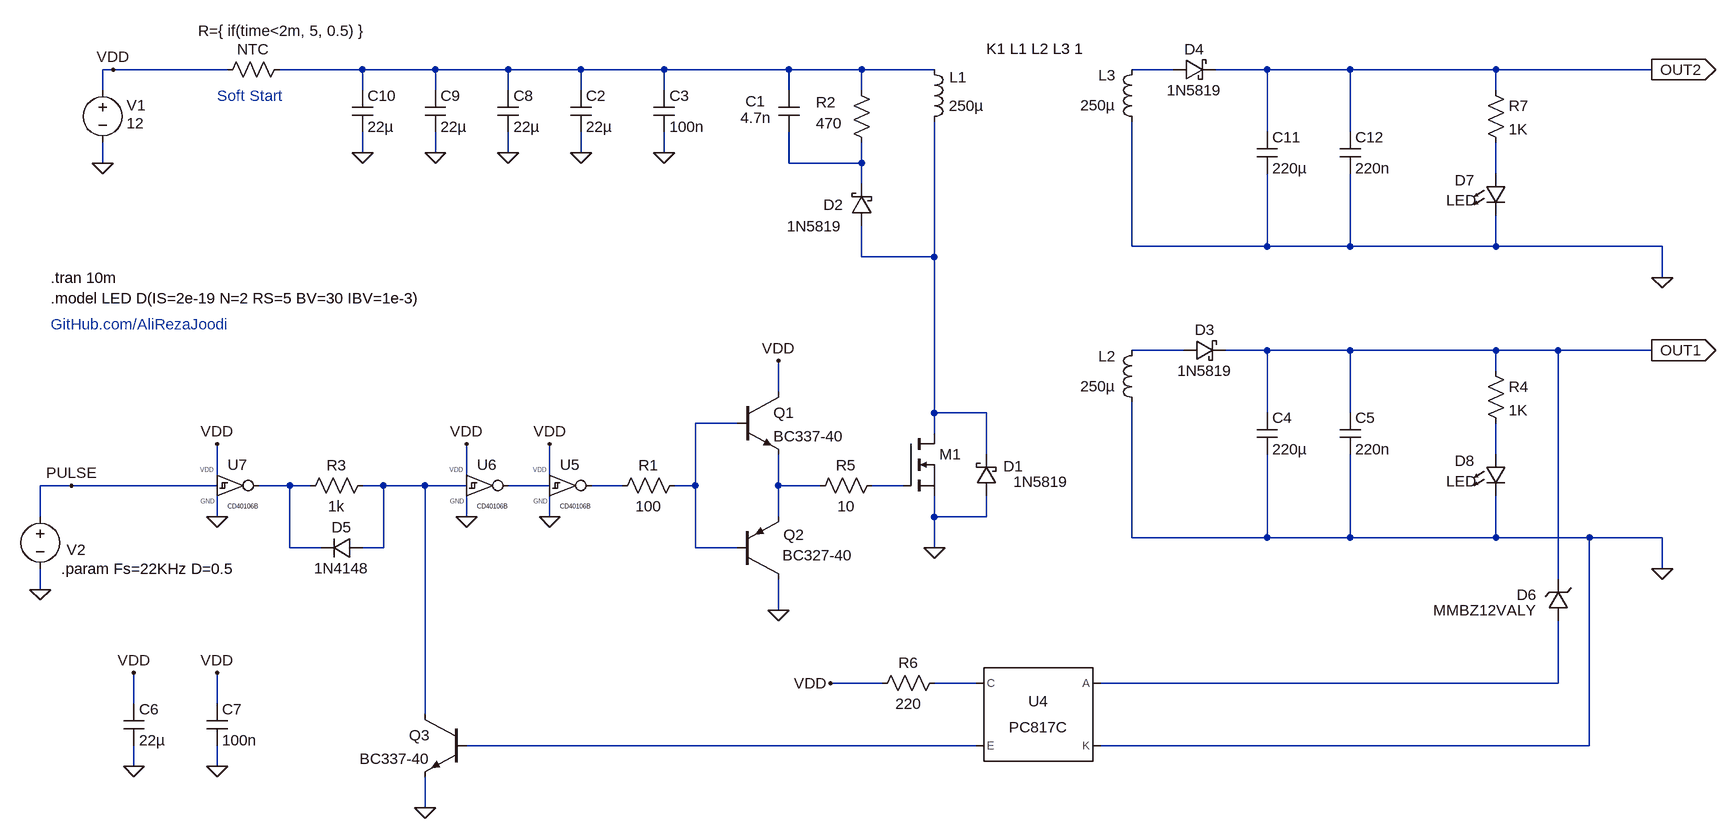
[diagram p0: schematic v1.0.asc]
v1.0.asc, the LTspice schematic file:
Version 4.1
SHEET 1 2620 1460
WIRE -48 192 -64 192
WIRE 128 192 -48 192
WIRE 336 192 208 192
WIRE 448 192 336 192
WIRE 560 192 448 192
WIRE 672 192 560 192
WIRE 800 192 672 192
WIRE 992 192 800 192
WIRE 1104 192 992 192
WIRE 1216 192 1104 192
WIRE 1584 192 1520 192
WIRE 1728 192 1648 192
WIRE 1856 192 1728 192
WIRE 2080 192 1856 192
WIRE 2320 192 2080 192
WIRE -64 224 -64 192
WIRE 336 224 336 192
WIRE 448 224 448 192
WIRE 560 224 560 192
WIRE 672 224 672 192
WIRE 800 224 800 192
WIRE 992 224 992 192
WIRE 1104 224 1104 192
WIRE 2080 224 2080 192
WIRE 1728 288 1728 192
WIRE 1856 288 1856 192
WIRE 336 320 336 288
WIRE 448 320 448 288
WIRE 560 320 560 288
WIRE 672 320 672 288
WIRE 800 320 800 288
WIRE -64 336 -64 304
WIRE 992 336 992 288
WIRE 1104 336 1104 304
WIRE 1104 336 992 336
WIRE 2080 352 2080 304
WIRE 1104 368 1104 336
WIRE 1520 464 1520 272
WIRE 1728 464 1728 352
WIRE 1728 464 1520 464
WIRE 1856 464 1856 352
WIRE 1856 464 1728 464
WIRE 2080 464 2080 416
WIRE 2080 464 1856 464
WIRE 2336 464 2080 464
WIRE 1104 480 1104 432
WIRE 1216 480 1216 272
WIRE 1216 480 1104 480
WIRE 2336 512 2336 464
WIRE 1600 624 1520 624
WIRE 1728 624 1664 624
WIRE 1856 624 1728 624
WIRE 2080 624 1856 624
WIRE 2176 624 2080 624
WIRE 2320 624 2176 624
WIRE 2080 656 2080 624
WIRE 976 688 976 640
WIRE 1216 720 1216 480
WIRE 1296 720 1216 720
WIRE 1728 720 1728 624
WIRE 1856 720 1856 624
WIRE 912 736 848 736
WIRE 1216 752 1216 720
WIRE 1296 784 1296 720
WIRE 2080 784 2080 736
WIRE 112 816 112 768
WIRE 496 816 496 768
WIRE 624 816 624 768
WIRE -112 832 -160 832
WIRE 112 832 -112 832
WIRE 224 832 176 832
WIRE 256 832 224 832
WIRE 368 832 336 832
WIRE 432 832 368 832
WIRE 496 832 432 832
WIRE 624 832 560 832
WIRE 736 832 688 832
WIRE 848 832 848 736
WIRE 848 832 816 832
WIRE 976 832 976 784
WIRE 1040 832 976 832
WIRE 1168 832 1120 832
WIRE -160 880 -160 832
WIRE 112 880 112 848
WIRE 496 880 496 848
WIRE 624 880 624 848
WIRE 976 880 976 832
WIRE 1216 880 1216 848
WIRE 1296 880 1296 848
WIRE 1296 880 1216 880
WIRE 1520 912 1520 704
WIRE 1728 912 1728 784
WIRE 1728 912 1520 912
WIRE 1856 912 1856 784
WIRE 1856 912 1728 912
WIRE 2080 912 2080 848
WIRE 2080 912 1856 912
WIRE 2224 912 2080 912
WIRE 2336 912 2224 912
WIRE 224 928 224 832
WIRE 272 928 224 928
WIRE 368 928 368 832
WIRE 368 928 336 928
WIRE 848 928 848 832
WIRE 912 928 848 928
WIRE 1216 928 1216 880
WIRE 2336 960 2336 912
WIRE 2176 976 2176 624
WIRE -160 992 -160 960
WIRE 976 1024 976 976
WIRE 1136 1136 1056 1136
WIRE 1280 1136 1216 1136
WIRE 2176 1136 2176 1040
WIRE 2176 1136 1472 1136
WIRE -16 1168 -16 1120
WIRE 112 1168 112 1120
WIRE 432 1184 432 832
WIRE 1280 1232 496 1232
WIRE 2224 1232 2224 912
WIRE 2224 1232 1472 1232
WIRE -16 1264 -16 1232
WIRE 112 1264 112 1232
WIRE 432 1328 432 1280
FLAG -64 336 0
FLAG -160 992 0
FLAG -112 832 PULSE
FLAG 1216 928 0
FLAG 672 320 0
FLAG 800 320 0
FLAG 2336 960 0
FLAG 2320 624 OUT1
IOPIN 2320 624 Out
FLAG -48 192 VDD
FLAG 976 640 VDD
FLAG 976 1024 0
FLAG 112 880 0
FLAG 112 768 VDD
FLAG 496 880 0
FLAG 496 768 VDD
FLAG 624 880 0
FLAG 624 768 VDD
FLAG 432 1328 0
FLAG 1056 1136 VDD
FLAG -16 1120 VDD
FLAG -16 1264 0
FLAG 112 1264 0
FLAG 560 320 0
FLAG 448 320 0
FLAG 336 320 0
FLAG 2336 512 0
FLAG 2320 192 OUT2
IOPIN 2320 192 Out
FLAG 112 1120 VDD
SYMBOL voltage -64 208 R0
WINDOW 123 0 0 Left 0
WINDOW 39 24 105 Left 2
WINDOW 0 37 39 Left 2
WINDOW 3 37 67 Left 2
SYMATTR InstName V1
SYMATTR Value 12
SYMBOL voltage -160 864 R0
WINDOW 123 0 0 Left 0
WINDOW 39 0 0 Left 0
WINDOW 0 41 67 Left 2
WINDOW 3 -361 80 Invisible 2
SYMATTR InstName V2
SYMATTR Value PULSE(0 9 0 {0.01/Fs} {0.01/Fs} {D/Fs} {1/Fs})
SYMBOL ind 1200 288 M180
WINDOW 0 39 84 Left 2
WINDOW 3 38 40 Left 2
SYMATTR InstName L1
SYMATTR Value 250µ
SYMATTR SpiceLine Rser=0.07
SYMATTR Type ind
SYMBOL cap 1008 288 R180
WINDOW 0 52 47 Left 2
WINDOW 3 43 22 Left 2
SYMATTR InstName C1
SYMATTR Value 4.7n
SYMBOL res 1088 208 R0
WINDOW 0 -54 34 Left 2
WINDOW 3 -54 67 Left 2
SYMATTR InstName R2
SYMATTR Value 470
SYMBOL nmos 1168 752 R0
WINDOW 3 56 72 Invisible 2
SYMATTR Value BSC100N06LS3
SYMATTR InstName M1
SYMBOL cap 656 224 R0
SYMATTR InstName C2
SYMATTR Value 22µ
SYMBOL schottky 1120 432 R180
WINDOW 0 44 32 Left 2
WINDOW 3 131 -1 Right 2
SYMATTR InstName D2
SYMATTR Value 1N5819
SYMBOL cap 784 224 R0
SYMATTR InstName C3
SYMATTR Value 100n
SYMBOL schottky 1312 848 R180
WINDOW 0 -41 46 Left 2
WINDOW 3 -110 22 Left 2
SYMATTR InstName D1
SYMATTR Value 1N5819
SYMBOL ind 1536 608 M0
WINDOW 0 41 25 Left 2
WINDOW 3 41 71 Left 2
SYMATTR InstName L2
SYMATTR Value 250µ
SYMATTR SpiceLine Rser=0.07
SYMATTR Type ind
SYMBOL schottky 1600 640 R270
WINDOW 0 32 32 VTop 2
WINDOW 3 0 32 VBottom 2
SYMATTR InstName D3
SYMATTR Value 1N5819
SYMBOL cap 1712 720 R0
SYMATTR InstName C4
SYMATTR Value 220µ
SYMBOL cap 1840 720 R0
SYMATTR InstName C5
SYMATTR Value 220n
SYMBOL res 2064 640 R0
SYMATTR InstName R4
SYMATTR Value 1K
SYMBOL npn 912 688 R0
SYMATTR InstName Q1
SYMATTR Value BC337-40
SYMBOL pnp 912 976 M180
WINDOW 0 72 68 Left 2
WINDOW 3 70 37 Left 2
SYMATTR InstName Q2
SYMATTR Value BC327-40
SYMBOL res 1024 848 R270
WINDOW 0 32 56 VTop 2
WINDOW 3 0 56 VBottom 2
SYMATTR InstName R5
SYMATTR Value 10
SYMBOL res 720 848 R270
WINDOW 0 32 56 VTop 2
WINDOW 3 0 56 VBottom 2
SYMATTR InstName R1
SYMATTR Value 100
SYMBOL res 240 848 R270
WINDOW 0 32 56 VTop 2
WINDOW 3 0 56 VBottom 2
SYMATTR InstName R3
SYMATTR Value 1k
SYMBOL diode 336 912 R90
WINDOW 0 0 32 VBottom 2
WINDOW 3 32 32 VTop 2
SYMATTR InstName D5
SYMATTR Value 1N4148
SYMBOL npn 496 1184 M0
SYMATTR InstName Q3
SYMATTR Value BC337-40
SYMBOL res 1120 1152 R270
WINDOW 0 32 56 VTop 2
WINDOW 3 0 56 VBottom 2
SYMATTR InstName R6
SYMATTR Value 220
SYMBOL Optos\\PC817C 1376 1184 M0
SYMATTR InstName U4
SYMBOL zener 2192 1040 R180
WINDOW 0 49 40 Left 2
WINDOW 3 49 16 Left 2
SYMATTR InstName D6
SYMATTR Value MMBZ12VALY
SYMBOL cap -32 1168 R0
SYMATTR InstName C6
SYMATTR Value 22µ
SYMBOL cap 96 1168 R0
SYMATTR InstName C7
SYMATTR Value 100n
SYMBOL cap 544 224 R0
SYMATTR InstName C8
SYMATTR Value 22µ
SYMBOL cap 432 224 R0
SYMATTR InstName C9
SYMATTR Value 22µ
SYMBOL cap 320 224 R0
SYMATTR InstName C10
SYMATTR Value 22µ
SYMBOL ind 1536 176 M0
WINDOW 0 41 25 Left 2
WINDOW 3 41 71 Left 2
SYMATTR InstName L3
SYMATTR Value 250µ
SYMATTR SpiceLine Rser=0.07
SYMATTR Type ind
SYMBOL schottky 1584 208 R270
WINDOW 0 32 32 VTop 2
WINDOW 3 0 32 VBottom 2
SYMATTR InstName D4
SYMATTR Value 1N5819
SYMBOL cap 1712 288 R0
SYMATTR InstName C11
SYMATTR Value 220µ
SYMBOL cap 1840 288 R0
SYMATTR InstName C12
SYMATTR Value 220n
SYMBOL res 2064 208 R0
SYMATTR InstName R7
SYMATTR Value 1K
SYMBOL res 112 208 R270
WINDOW 0 32 56 VTop 2
WINDOW 3 91 100 VBottom 2
SYMATTR InstName NTC
SYMATTR Value R={ if(time<2m, 5, 0.5) }
SYMBOL MyLib\\Digital\\CD40106B 624 800 R0
WINDOW 38 16 64 Left 0
SYMATTR InstName U5
SYMBOL MyLib\\Digital\\CD40106B 496 800 R0
WINDOW 38 16 64 Left 0
SYMATTR InstName U6
SYMBOL MyLib\\Digital\\CD40106B 112 800 R0
WINDOW 38 16 64 Left 0
SYMATTR InstName U7
SYMBOL LED 2064 352 R0
WINDOW 0 -47 10 Left 2
WINDOW 3 -60 41 Left 2
SYMATTR InstName D7
SYMATTR Value LED
SYMBOL LED 2064 784 R0
WINDOW 0 -47 10 Left 2
WINDOW 3 -60 41 Left 2
SYMATTR InstName D8
SYMATTR Value LED
TEXT -144 512 Left 2 !.tran 10m
TEXT 1296 160 Left 2 !K1 L1 L2 L3 1
TEXT -128 960 Left 2 !.param Fs=22KHz D=0.5
TEXT 112 232 Left 2 ;Soft Start
TEXT -144 544 Left 2 !.model LED D(IS=2e-19 N=2 RS=5 BV=30 IBV=1e-3)
TEXT -144 584 Left 2 ;GitHub.com/AliRezaJoodi

The netlist it stands for:
* v1.0.asc
V1 VDD 0 12
V2 PULSE 0 PULSE(0 9 0 {0.01/Fs} {0.01/Fs} {D/Fs} {1/Fs})
L1 N005 N001 250µ Rser=0.07
C1 N003 N001 4.7n
R2 N001 N003 470
M1 N005 N014 0 0 BSC100N06LS3
C2 N001 0 22µ
D2 N005 N003 1N5819
C3 N001 0 100n
D1 0 N005 1N5819
L2 N006 0 250µ Rser=0.07
D3 N006 OUT1 1N5819
C4 OUT1 0 220µ
C5 OUT1 0 220n
R4 OUT1 N008 1K
Q1 VDD N007 N013 0 BC337-40
Q2 0 N007 N013 0 BC327-40
R5 N013 N014 10
R1 N012 N007 100
R3 N009 N010 1k
D5 N010 N009 1N4148
Q3 N010 N017 0 0 BC337-40
R6 VDD N015 220
X§U4 N016 0 N015 N017 PC817 Igain=2.3m  ; PC817C, pins A K C E
D6 N016 OUT1 MMBZ12VALY
C6 VDD 0 22µ
C7 VDD 0 100n
C8 N001 0 22µ
C9 N001 0 22µ
C10 N001 0 22µ
L3 N002 0 250µ Rser=0.07
D4 N002 OUT2 1N5819
C11 OUT2 0 220µ
C12 OUT2 0 220n
R7 OUT2 N004 1K
R§NTC VDD N001 R={ if(time<2m, 5, 0.5) }
X§U5 N011 N012 VDD 0 CD40106B vdd=5 speed=2 tripdt=100n  ; pins in out VDD GND
X§U6 N010 N011 VDD 0 CD40106B vdd=5 speed=2 tripdt=100n  ; pins in out VDD GND
X§U7 PULSE N009 VDD 0 CD40106B vdd=5 speed=2 tripdt=100n  ; pins in out VDD GND
D7 N004 0 LED
D8 N008 0 LED
.model D D
.lib standard.dio
.model NPN NPN
.model PNP PNP
.lib standard.bjt
.model NMOS NMOS
.model PMOS PMOS
.lib standard.mos
.tran 10m
K1 L1 L2 L3 1
.param Fs=22KHz D=0.5
* Soft Start
.model LED D(IS=2e-19 N=2 RS=5 BV=30 IBV=1e-3)
* GitHub.com/AliRezaJoodi
.lib PC817.sub
.lib MyLib/Digital/_CD4xxx.lib
.backanno
.end